# Altium schematic sheet indication.SchDoc
size A4; SheetNumber: 4; SheetTotal: 7
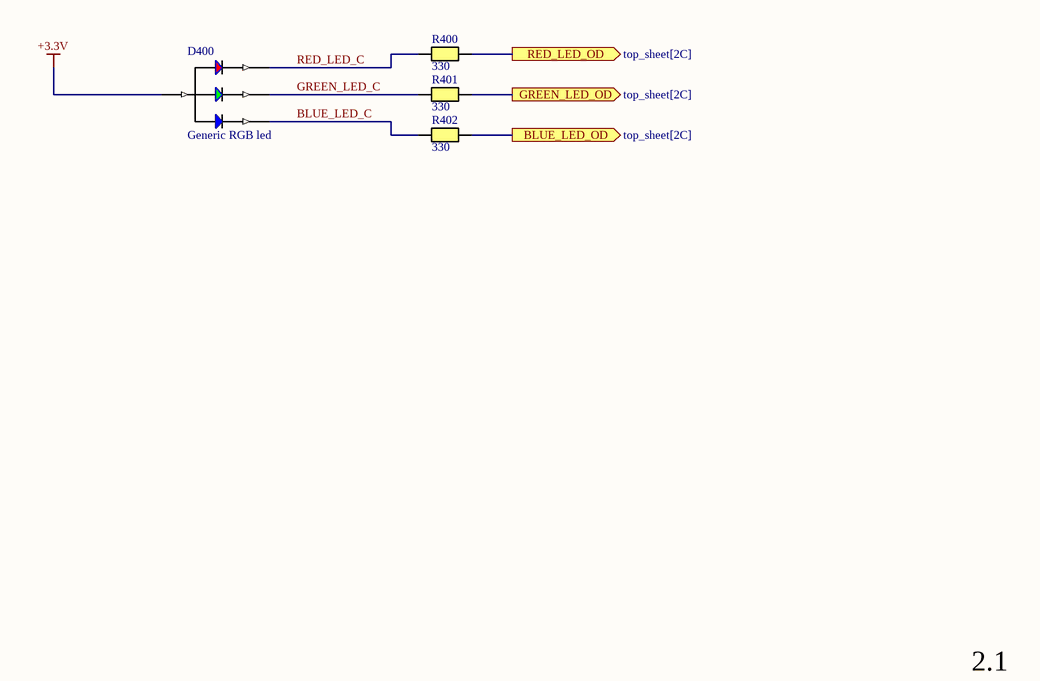
[diagram p0: indication.SchDoc]

## Parts
D400  Generic RGB led  [RGB throu hole 90 deg]
R400  330  [RESC0603(1608)_N]
R401  330  [RESC0603(1608)_N]
R402  330  [RESC0603(1608)_N]

## Ports
BLUE_LED_OD (out, see top_sheet[2C]), GREEN_LED_OD (out, see top_sheet[2C]), RED_LED_OD (out, see top_sheet[2C])

## Nets
+3.3V: D400.CA
BLUE_LED_C: D400.BC R402.1
BLUE_LED_OD: R402.2 ; port BLUE_LED_OD
GREEN_LED_C: D400.GC R401.1
GREEN_LED_OD: R401.2 ; port GREEN_LED_OD
RED_LED_C: D400.RC R400.1
RED_LED_OD: R400.2 ; port RED_LED_OD

## Notes on the sheet
- 2.1

## Library data of the parts
D400 = RGB led
R400-R402 = Resistor M: Resistor Medium Density; Value: 330